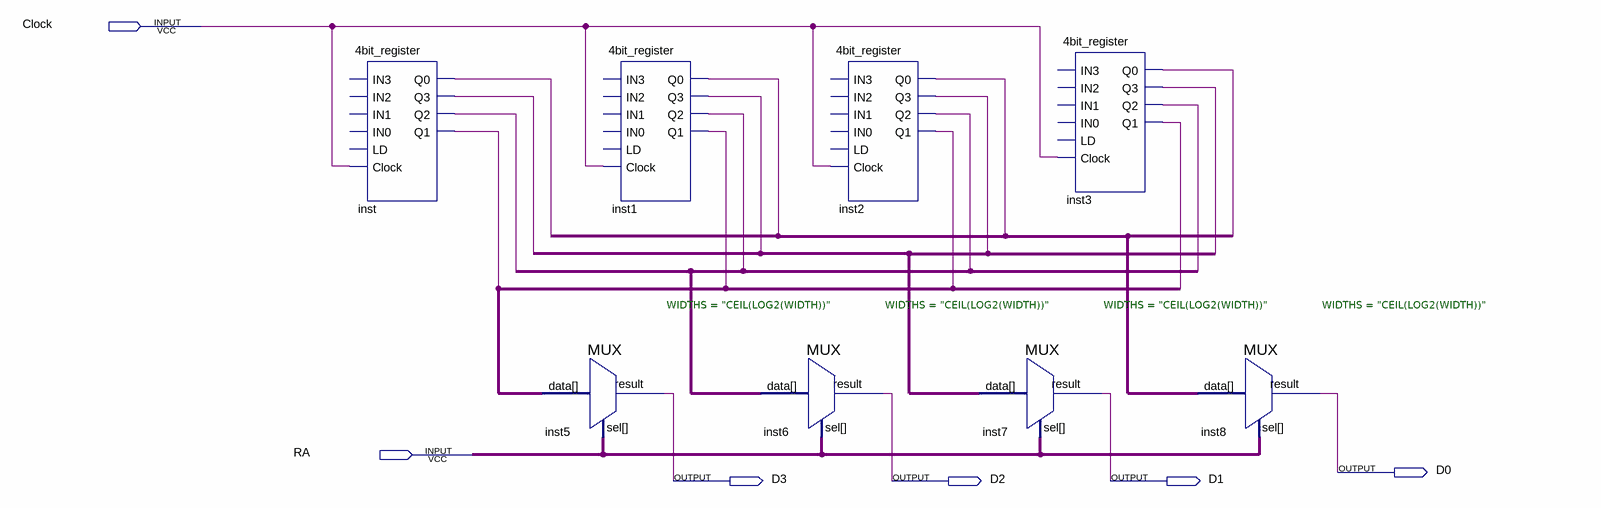
[diagram p0: schematic sheet]
// Quartus schematic 4bit_4register_file.bdf as structural Verilog: 8 symbols, 6 pins
module \4bit_4register_file  (
  input  Clock,
  input  RA,
  output D0,
  output D3,
  output D2,
  output D1
);

  wire inst_q0, inst_q1, inst_q2, inst_q3;

  \4bit_register  inst (
    .Clock(Clock), .Q0(inst_q0), .Q3(inst_q3), .Q2(inst_q2), .Q1(inst_q1));  // open: IN3, IN2, IN1, IN0, LD
  \4bit_register  inst1 (
    .Clock(Clock), .Q0(inst_q0), .Q3(inst_q3), .Q2(inst_q2), .Q1(inst_q1));  // open: IN3, IN2, IN1, IN0, LD
  MUX #(.WIDTHS("CEIL(LOG2(WIDTH))")) inst5 (.data(inst_q1), .sel(RA), .result(D3));
  MUX #(.WIDTHS("CEIL(LOG2(WIDTH))")) inst6 (.data(inst_q2), .sel(RA), .result(D2));
  \4bit_register  inst2 (
    .Clock(Clock), .Q0(inst_q0), .Q3(inst_q3), .Q2(inst_q2), .Q1(inst_q1));  // open: IN3, IN2, IN1, IN0, LD
  MUX #(.WIDTHS("CEIL(LOG2(WIDTH))")) inst7 (.data(inst_q3), .sel(RA), .result(D1));
  \4bit_register  inst3 (
    .Clock(Clock), .Q0(inst_q0), .Q3(inst_q3), .Q2(inst_q2), .Q1(inst_q1));  // open: IN3, IN2, IN1, IN0, LD
  MUX #(.WIDTHS("CEIL(LOG2(WIDTH))")) inst8 (.data(inst_q0), .sel(RA), .result(D0));
endmodule
